# EAGLE design SaLAltimeter (EAGLE 7.5.0)
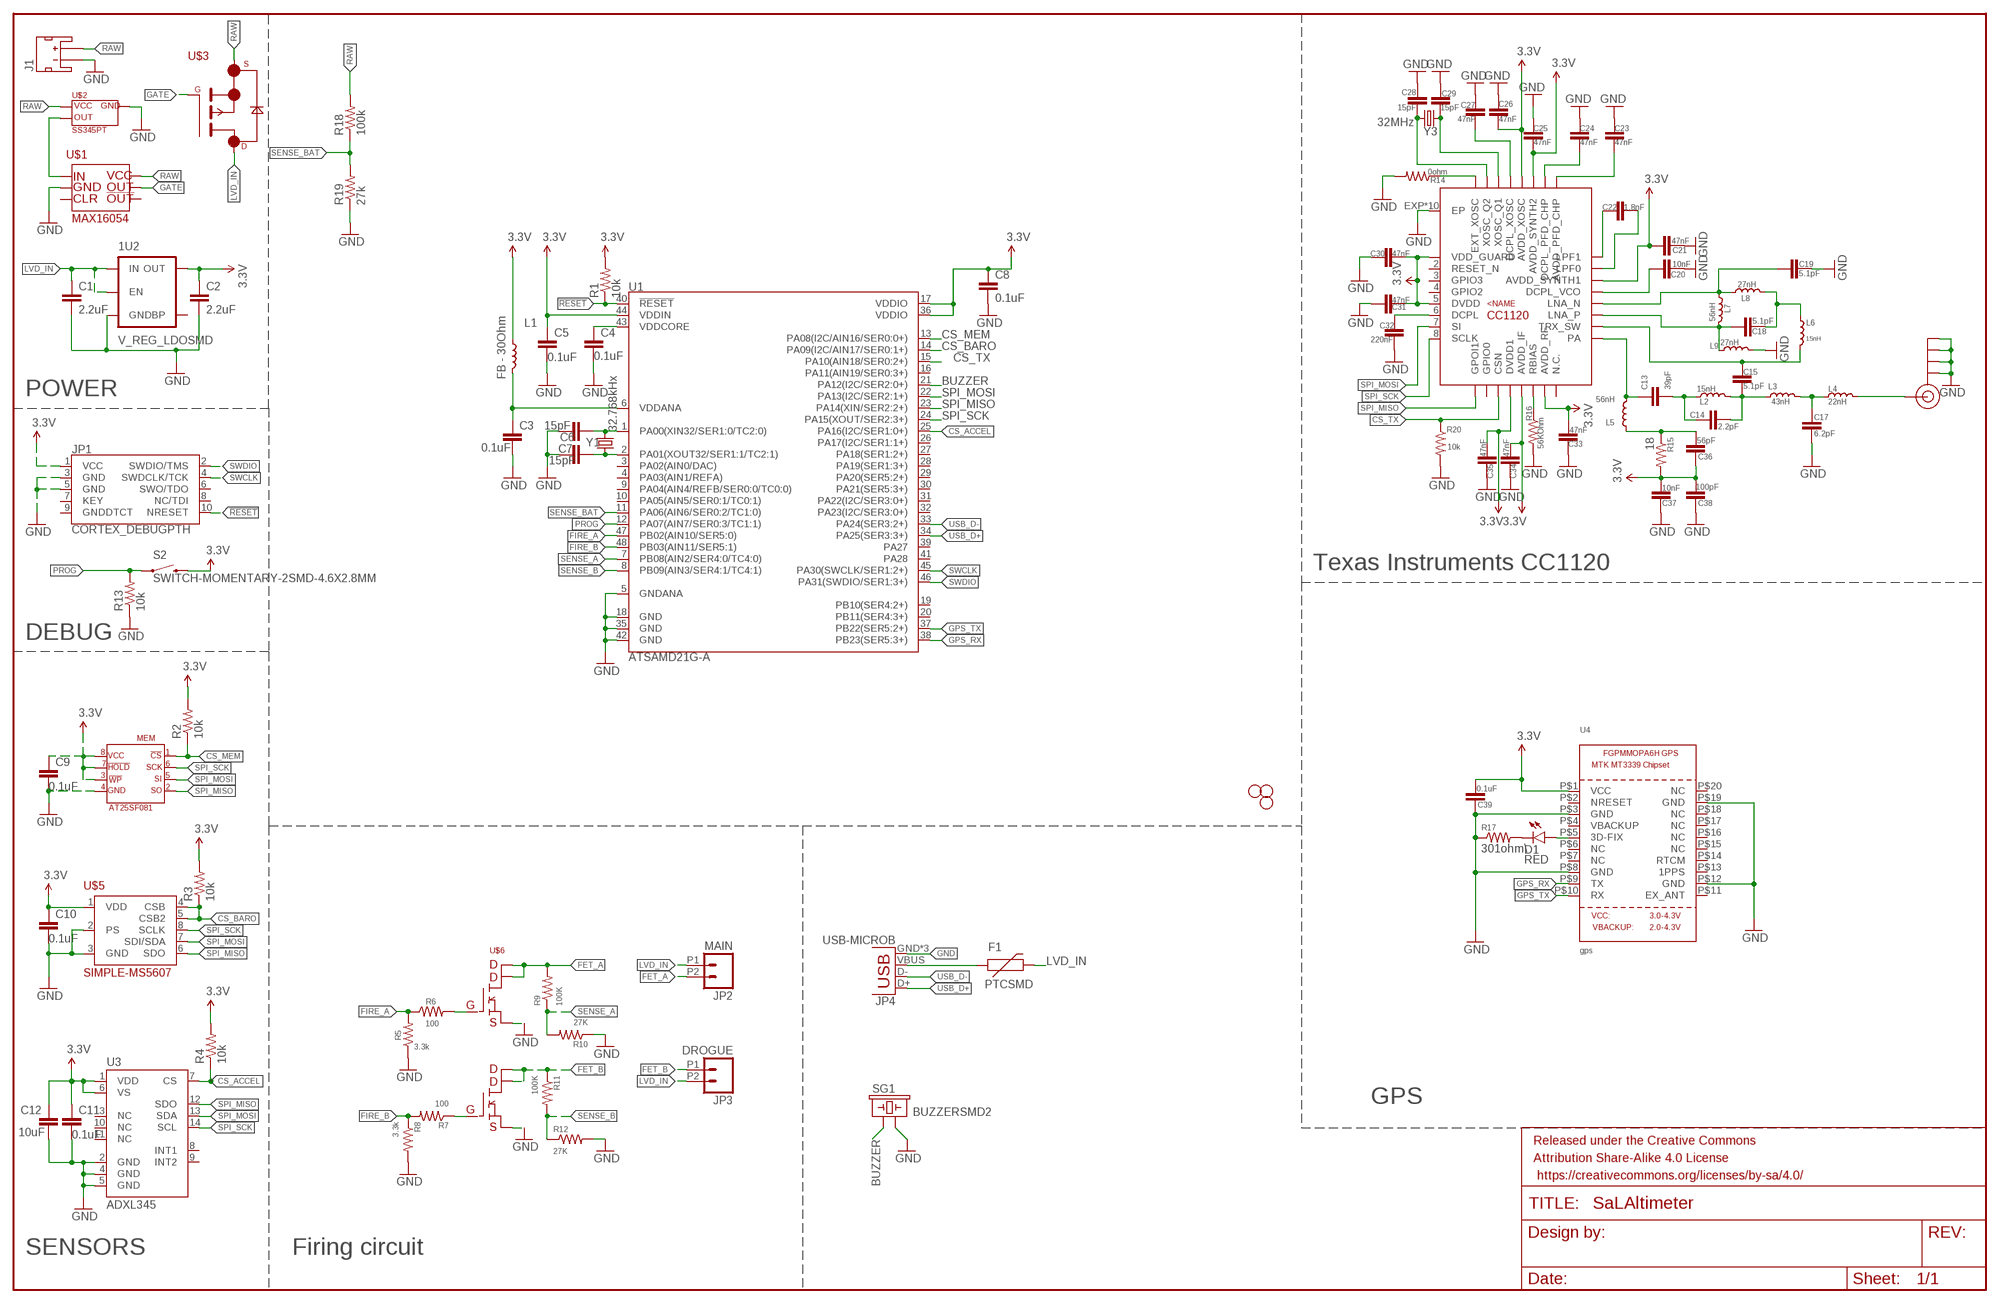
[diagram p0: schematic, sheet 1]

## Parts
1U2  V_REG_LDOSMD  [SOT23-5]
C1  2.2uF  CAP0603-CAP  [0603-CAP]
C2  2.2uF  CAP0603-CAP  [0603-CAP]
C3  0.1uF  CAP0402-CAP  [0402-CAP]
C4  0.1uF  CAP0402-CAP  [0402-CAP]
C5  0.1uF  CAP0402-CAP  [0402-CAP]
C6  15pF  CAP0402-CAP  [0402-CAP]
C7  15pF  CAP0402-CAP  [0402-CAP]
C8  0.1uF  CAP0402-CAP  [0402-CAP]
C9  0.1uF  CAP0402-CAP  [0402-CAP]
C10  0.1uF  CAP0402-CAP  [0402-CAP]
C11  0.1uF  CAP0402-CAP  [0402-CAP]
C12  10uF  CAP0402-CAP  [0402-CAP]
C13  39pF  CAP0402-CAP  [0402-CAP]
C14  2.2pF  CAP0402-CAP  [0402-CAP]
C15  5.1pF  CAP0402-CAP  [0402-CAP]
C17  6.2pF  CAP0402-CAP  [0402-CAP]
C18  5.1pF  CAP0402-CAP  [0402-CAP]
C19  5.1pF  CAP0402-CAP  [0402-CAP]
C20  10nF  CAP0402-CAP  [0402-CAP]
C21  47nF  CAP0402-CAP  [0402-CAP]
C22  1.8nF  CAP0402-CAP  [0402-CAP]
C23  47nF  CAP0402-CAP  [0402-CAP]
C24  47nF  CAP0402-CAP  [0402-CAP]
C25  47nF  CAP0402-CAP  [0402-CAP]
C26  47nF  CAP0402-CAP  [0402-CAP]
C27  47nF  CAP0402-CAP  [0402-CAP]
C28  15pF  CAP0402-CAP  [0402-CAP]
C29  15pF  CAP0402-CAP  [0402-CAP]
C30  47nF  CAP0402-CAP  [0402-CAP]
C31  47nF  CAP0402-CAP  [0402-CAP]
C32  220nF  CAP0402-CAP  [0402-CAP]
C33  47nF  CAP0402-CAP  [0402-CAP]
C34  47nF  CAP0402-CAP  [0402-CAP]
C35  47nF  CAP0402-CAP  [0402-CAP]
C36  56pF  CAP0402-CAP  [0402-CAP]
C37  10nF  CAP0402-CAP  [0402-CAP]
C38  100pF  CAP0402-CAP  [0402-CAP]
C39  0.1uF  CAP0402-CAP  [0402-CAP]
D1  RED  LED-RED0603  [LED-0603]
F1  PTCSMD  [PTC-1206]
FRAME1  FRAME-LEDGER  [CREATIVE_COMMONS]
J1  BAT  JST_2MM_MALE  [JST-2-SMD]
J$1  SMA_EDGE  [SMA-EDGE]
JP1  CORTEX_DEBUGPTH  [2X5-PTH-1.27MM]
JP2  MAIN  M022.54MM_SCREWTERM  [1X02_2.54_SCREWTERM]
JP3  DROGUE  M022.54MM_SCREWTERM  [1X02_2.54_SCREWTERM]
JP4  USB-MICROB  [USB-MICROB]
L1  FB - 30Ohm  INDUCTOR0603  [0603]
L2  15nH  INDUCTOR0402  [C0402]
L3  43nH  INDUCTOR0402  [C0402]
L4  22nH  INDUCTOR0402  [C0402]
L5  56nH  INDUCTOR0402  [C0402]
L6  15nH  INDUCTOR0402  [C0402]
L7  56nH  INDUCTOR0402  [C0402]
L8  27nH  INDUCTOR0402  [C0402]
L9  27nH  INDUCTOR0402  [C0402]
MEM  AT25SF081  [AT25SF081]
R1  10k  RESISTOR0402-RES  [0402-RES]
R2  10k  RESISTOR0402-RES  [0402-RES]
R3  10k  RESISTOR0402-RES  [0402-RES]
R4  10k  RESISTOR0402-RES  [0402-RES]
R5  3.3k  RESISTOR0402  [0402-RES]
R6  100  RESISTOR0402  [0402-RES]
R7  100  RESISTOR0402  [0402-RES]
R8  3.3k  RESISTOR0402  [0402-RES]
R9  100K  RESISTOR0402  [0402-RES]
R10  27K  RESISTOR0402  [0402-RES]
R11  100K  RESISTOR0402  [0402-RES]
R12  27K  RESISTOR0402  [0402-RES]
R13  10k  RESISTOR0402-RES  [0402-RES]
R14  0ohm  RESISTOR0402-RES  [0402-RES]
R15  18  RESISTOR0402-RES  [0402-RES]
R16  56KOhm  RESISTOR0402-RES  [0402-RES]
R17  301ohm\  RESISTOR0402-RES  [0402-RES]
R18  100k  RESISTOR0402-RES  [0402-RES]
R19  27k  RESISTOR0402-RES  [0402-RES]
R20  10k  RESISTOR0402-RES  [0402-RES]
S2  SWITCH-MOMENTARY-2SMD-4.6X2.8MM  [TACTILE_SWITCH_SMD_4.6X2.8MM]
SG1  BUZZERSMD2  [BUZZER-CCV]
STANDOFF1  STAND-OFF  [STAND-OFF]
STANDOFF2  STAND-OFF  [STAND-OFF]
STANDOFF3  STAND-OFF  [STAND-OFF]
U1  ATSAMD21G-A  [TQFP-48]
U2  CC1120  [CC1120]
U3  ADXL345  [LGA14]
U4  gps  GPS_FGPMMOPA6H  [FGPMMOPA6H]
U$1  MAX16054  [MAX16054]
U$2  SS345PT  [SS345PT]
U$3  SI7615ADN  [SI7615ADN]
U$5  SIMPLE-MS5607  [MS5607]
U$6  SI7232DN  [SI7232DN]
Y1  32.768kHx  CRYSTAL3.2X1.5MM  [CRYSTAL-SMD-3.2X1.5MM]
Y3  32MHz  CRYSTAL5X3  [CRYSTAL-SMD-5X3]

## Nets
3.3V: 1U2.5(OUT) C2.1 C5.1 C8.1 C9.1 C10.1 C11.1 C12.1 C21.1 C25.2 C26.2 C30.2 C31.2 C33.2 C34.2 C35.2 C36.1 C37.2 C38.2 C39.2 JP1.1(VCC) L1.1 MEM.!HOLD MEM.!WP MEM.VCC R1.2 R2.2 R3.2 R4.2 R15.2 S2.3 S2.4 U1.17(VDDIO) U1.36(VDDIO) U1.44(VDDIN) U2.1(VDD_GUARD) U2.5(DVDD) U2.12(DVDD1) U2.13(AVDD_IF) U2.15(AVDD_RF) U2.22(AVDD_SYNTH1) U2.27(AVDD_SYNTH2) U2.28(AVDD_XOSC) U3.1(VDD) U3.6(VS) U4.P$1(VCC) U$5.1(VDD)
!RESET: JP1.10(NRESET) R1.1 U1.40(!RESET!)
BUZZER: SG1.+ U1.21(PA12(I2C/SER2:0+))
CS_ACCEL: R4.1 U1.25(PA16(I2C/SER1:0+)) U3.7(CS)
CS_BARO: R3.1 U1.14(PA09(I2C/AIN17/SER0:1+)) U$5.4(CSB) U$5.5(CSB2)
CS_MEM: MEM.!CS R2.1 U1.13(PA08(I2C/AIN16/SER0:0+))
CS_TX: R20.1 U1.15(PA10(AIN18/SER0:2+)) U2.11(CSN)
FET_A: JP2.P2 R9.2 U$6.7(PIN7) U$6.8(PIN8)
FET_B: JP3.P1 R11.1 U$6.5(PIN5) U$6.6(PIN6)
FIRE_A: R5.2 R6.1 U1.47(PB02(AIN10/SER5:0))
FIRE_B: R7.2 R8.1 U1.48(PB03(AIN11/SER5:1))
GATE: U$1.OUT U$3.G
GND: 1U2.2(GND) C1.2 C2.2 C3.2 C4.2 C5.2 C6.2 C7.2 C8.2 C9.2 C10.2 C11.2 C12.2 C17.2 C19.2 C20.2 C21.2 C23.1 C24.1 C25.1 C26.1 C27.1 C28.1 C29.1 C30.1 C31.1 C32.1 C33.1 C34.1 C35.1 C37.1 C38.1 C39.1 J1.1(-) J$1.GND@0(GND) J$1.GND@1(GND) J$1.GND@2(GND) J$1.GND@3(GND) JP1.3(GND) JP1.5(GND) JP4.GND JP4.MT1(GND) JP4.MT2(GND) L9.2 MEM.GND R5.1 R8.2 R10.1 R12.2 R13.1 R14.2 R16.2 R17.1 R19.1 R20.2 SG1.- U1.5(GNDANA) U1.18(GND) U1.35(GND) U1.42(GND) U2.EXP(EP) U2.EXP@1(EP) U2.EXP@2(EP) U2.EXP@3(EP) U2.EXP@4(EP) U2.EXP@5(EP) U2.EXP@6(EP) U2.EXP@7(EP) U2.EXP@8(EP) U2.EXP@9(EP) U3.2(GND) U3.4(GND) U3.5(GND) U4.P$3(GND) U4.P$8(GND) U4.P$12(GND) U4.P$19(GND) U$1.GND U$2.GND U$5.2(PS) U$5.3(GND) U$6.1(PIN1) U$6.3(PIN3)
GPS_RX: U1.38(PB23(SER5:3+)) U4.P$9(TX)
GPS_TX: U1.37(PB22(SER5:2+)) U4.P$10(RX)
LVD_IN: 1U2.1(IN) 1U2.3(EN) C1.1 F1.2 JP2.P1 JP3.P2 U$3.D1(D) U$3.D2(D) U$3.D3(D) U$3.D4(D)
N$1: R6.2 U$6.2(PIN2)
N$2: U$1.IN U$2.OUT
N$3: C6.1 U1.1(PA00(XIN32/SER1:0/TC2:0)) Y1.P$2
N$4: C7.1 U1.2(PA01(XOUT32/SER1:1/TC2:1)) Y1.P$1
N$5: C3.1 L1.2 U1.6(VDDANA)
N$6: C4.1 U1.43(VDDCORE)
N$8: R7.1 U$6.4(PIN4)
N$9: C13.1 L5.2 U2.17(PA)
N$10: C13.2 C14.1 L2.1
N$11: C14.2 C15.1 L2.2 L3.1
N$12: C17.1 L3.2 L4.1
N$13: J$1.SIG(SIGNAL) L4.2
N$14: F1.1 JP4.VBUS
N$15: C23.2 U2.25(AVDD_PFD_CHP)
N$16: C15.2 L6.2 U2.18(TRX_SW)
N$17: C18.1 L7.2 L9.1 U2.19(LNA_P)
N$18: C18.2 L6.1 L8.2
N$19: C19.1 L7.1 L8.1 U2.20(LNA_N)
N$20: C22.1 U2.24(LPF1)
N$21: C22.2 U2.23(LPF0)
N$22: C20.1 U2.21(DCPL_VCO)
N$23: C24.2 U2.26(DCPL_PFD_CHP)
N$24: R16.1 U2.14(RBIAS)
N$25: R14.1 U2.32(EXT_XOSC)
N$26: C27.2 U2.29(DCPL_XOSC)
N$27: C29.2 U2.30(XOSC_Q1) Y3.3
N$28: C28.2 U2.31(XOSC_Q2) Y3.1
N$30: D1.C R17.2
N$31: D1.A U4.P$5(3D-FIX)
N$34: C32.2 U2.6(DCPL)
N$38: C36.2 L5.1 R15.1
PROG: R13.2 S2.1 S2.2 U1.12(PA07(AIN7/SER0:3/TC1:1))
RAW: J1.2(+) R18.2 U$1.VCC U$2.VCC U$3.S1(S) U$3.S2(S) U$3.S3(S)
SENSE_A: R9.1 R10.2 U1.7(PB08(AIN2/SER4:0/TC4:0))
SENSE_B: R11.2 R12.1 U1.8(PB09(AIN3/SER4:1/TC4:1))
SENSE_BAT: R18.1 R19.2 U1.11(PA06(AIN6/SER0:2/TC1:0))
SPI_MISO: MEM.SO U1.23(PA14(XIN/SER2:2+)) U2.9(GPOI1) U3.12(SDO) U$5.6(SDO)
SPI_MOSI: MEM.SI U1.22(PA13(I2C/SER2:1+)) U2.7(SI) U3.13(SDA) U$5.7(SDI/SDA)
SPI_SCK: MEM.SCK U1.24(PA15(XOUT/SER2:3+)) U2.8(SCLK) U3.14(SCL) U$5.8(SCLK)
SWCLK: JP1.4(SWDCLK/TCK) U1.45(PA30(SWCLK/SER1:2+))
SWDIO: JP1.2(SWDIO/TMS) U1.46(PA31(SWDIO/SER1:3+))
USB_D+: JP4.D+ U1.34(PA25(SER3:3+))
USB_D-: JP4.D- U1.33(PA24(SER3:2+))
Unconnected: 1U2.4(BP) J1.NC1(PAD1) J1.NC2(PAD2) JP1.6(SWO/TDO) JP1.7(KEY) JP1.8(NC/TDI) JP1.9(GNDDTCT) U1.3(PA02(AIN0/DAC)) U1.4(PA03(AIN1/REFA)) U1.9(PA04(AIN4/REFB/SER0:0/TC0:0)) U1.10(PA05(AIN5/SER0:1/TC0:1)) U1.16(PA11(AIN19/SER0:3+)) U1.19(PB10(SER4:2+)) U1.20(PB11(SER4:3+)) U1.26(PA17(I2C/SER1:1+)) U1.27(PA18(SER1:2+)) U1.28(PA19(SER1:3+)) U1.29(PA20(SER5:2+)) U1.30(PA21(SER5:3+)) U1.31(PA22(I2C/SER3:0+)) U1.32(PA23(I2C/SER3:0+)) U1.39(PA27) U1.41(PA28) U2.2(RESET_N) U2.3(GPIO3) U2.4(GPIO2) U2.10(GPIO0) U2.16(N.C.) U3.3(NC) U3.8(INT1) U3.9(INT2) U3.10(NC) U3.11(NC) U4.P$2(NRESET) U4.P$4(VBACKUP) U4.P$6(NC) U4.P$7(NC) U4.P$11(EX_ANT) U4.P$13(1PPS) U4.P$14(RTCM) U4.P$15(NC) U4.P$16(NC) U4.P$17(NC) U4.P$18(NC) U4.P$20(NC) U$1.!OUT U$1.CLR

## Notes on the sheet
- POWER
- Texas Instruments CC1120
- DEBUG
- GPS
- SENSORS | Firing circuit

## Library data of the parts
1U2 = SparkFun-PowerIC:V_REG_LDO: Voltage Regulator LDO Standard 150mA LDO voltage regulator in SOT-23 layout. Micrel part MIC5205. BP (by-pass) pin is used to lower output noise with 470pF cap.
C1 C2 C13-C15 C17-C39 = SparkFun-Capacitors:CAP: Capacitor Standard 0603 ceramic capacitor, and 0.1" leaded capacitor.
C3-C12 = SparkFun-Passives:CAP: Capacitor Standard 0603 ceramic capacitor, and 0.1" leaded capacitor.
D1 = SparkFun-LED:LED-RED: Assorted Red LEDs LilyPad 1206- DIO-09912 1206- DIO-00809 0603- DIO-00819 "SMART" means more efficient and expensive; PROD_ID: DIO-00819
F1 = SparkFun-PowerIC:PTC: Resettable Fuse PTC Resettable Fuse. Spark Fun Electronics SKU : COM-08357; PROD_ID: RES-11150
FRAME1 = SparkFun-Aesthetics:FRAME-LEDGER: Schematic Frame Standard 11x14 US Ledger frame
J1 = SparkFun-Connectors:JST_2MM_MALE: Mates to single-cell LiPo batteries. CONN-11443 Now with smashable polarity marks!; BTM_NEG: -; BTM_POS: +; PROD_ID: CONN-11443; TOP_NEG: -; TOP_POS: +
J$1 = SparkFun-Connectors:SMA_EDGE: SMA Antenna Connector End launch SMA connector. The paste layer has been removed so that the connector can be hand soldered onto the board after reflow.
JP1 = SparkFun-Connectors:CORTEX_DEBUG: Cortex Debug Connector Datasheet <http://infocenter.arm.com/help/topic/com.arm.doc.faqs/attached/13634/cortex_debug_connectors.pdf>
JP2 JP3 = SparkFun-Connectors:M02: Standard 2-pin 0.1" header. Use with - straight break away headers ( PRT-00116) - right angle break away headers (PRT-00553) - swiss pins (PRT-00743) - machine pins (PRT-00117) - female headers (PRT-00115) Molex polarized connector foot print use with: PRT-08233 with associated crimp pins and housings. 2.54_SCREWTERM for use with PRT-10571. 3.5mm Screw Terminal footprints for PRT-08084 5mm Screw Terminal footprints for use with PRT-08432
JP4 = SparkFun-Connectors:USB: USB Connectors USB-B-PTH is fully proven SKU : PRT-00139/CONN-08278 USB-miniB is fully proven SKU : PRT-00587 USB-A-PCB is untested. USB-A-H is throughly reviewed, but untested. Spark Fun Electronics SKU : PRT-00437 USB-B-SMT is throughly reviewed, but untested. Needs silkscreen touching up. USB-A-S has not been used/tested USB-MB-H has not been used/tested USB-MICROB has been used. CONN-09505; PROD_ID: CONN-09505
L1-L9 = SparkFun-Passives:INDUCTOR: Inductors Basic Inductor/Choke - 0603 and 1206. Footprints are not proven and vary greatly between part numbers. INDUCTOR POWER 3.3UH 4.0A SMD 0.197" L x 0.197" W x 0.177" H (5.00mm x 5.00mm x 4.50mm)
MEM = SaL-lib:AT25SF081: AT25SF081 - 8M memory smd
R1-R4 R13-R20 = SparkFun-Passives:RESISTOR: Resistor Basic schematic elements and footprints for 0603, 1206, and PTH resistors.
R5-R12 = SparkFun-Resistors:RESISTOR: Resistor Basic schematic elements and footprints for 0603, 1206, and PTH resistors.
S2 = SparkFun-Electromechanical:SWITCH-MOMENTARY-2: Various NO switches- pushbuttons, reed, etc; PROD_ID: SWCH-13065
SG1 = SparkFun-Electromechanical:BUZZER: Buzzer 12mm Spark Fun Electronics SKU : Comp-Buzzer
STANDOFF1-STANDOFF3 = SparkFun-Electromechanical:STAND-OFF: #4 Stand Off This is the mechanical footprint for a #4 phillips button head screw. Use the keepout ring to avoid running the screw head into surrounding components. SKU : PRT-00447
U1 = SparkFun-DigitalIC:ATSAMD21G: Atmel SAMD21G SMART ARM-Based Microcontroller The Atmel ® | SMART ™ SAM D21 is a series of low-power microcontrollers using the 32-bit ARM ® Cortex ® -M0+ processor, and ranging from 32- to 64-pins with up to 256KB Flash and 32KB of SRAM. The SAM D21 devices operate at a maximum frequency of 48MHz and reach 2.46 CoreMark/MHz. They are designed for simple and intuitive migration with identical peripheral modules, hex compatible code, identical linear address map and pin compatible migration paths between all devices in the product series. All devices include intelligent and flexible peripherals, Atmel Event System for inter-peripheral signaling, and support for capacitive touch button, slider and wheel user interfaces.; PROD_ID: IC-13064
U2 = SaL-lib:CC1120
U3 = SparkFun-Sensors:ADXL345: 3-axis SPI/I2C 2/4/8/16g accelerometer
U4 = adafruit:GPS_FGPMMOPA6H: GPS Module - MTK MT3339 Chipset, -165dBm sensitivity, 22 channels, 10Hz, auto-select external antenna options
U$1 = SaL-lib:MAX16054
U$2 = SaL-lib:SS345PT
U$3 = SaL-lib:SI7615ADN
U$5 = MS5607:SIMPLE
U$6 = SaL-lib:SI7232DN: SI7232DN dual
Y1 = SparkFun-FreqCtrl:CRYSTAL: Various standard crystals. Proven footprints.
Y3 = SparkFun-FreqCtrl:CRYSTAL: Various standard crystals. Proven footprints.; PROD_ID: XTAL-08218

## Board
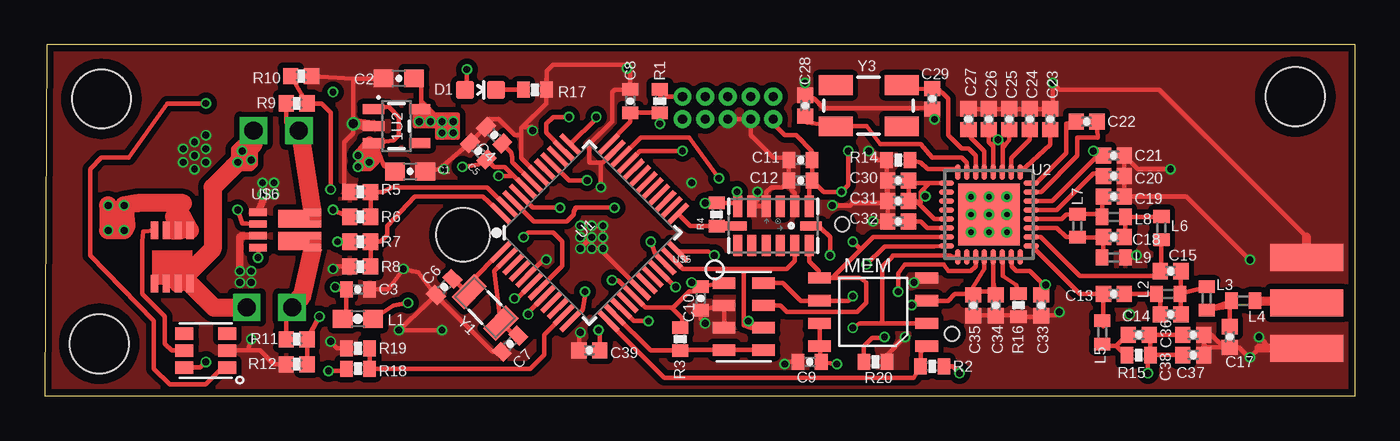
[diagram p1: board, top side]
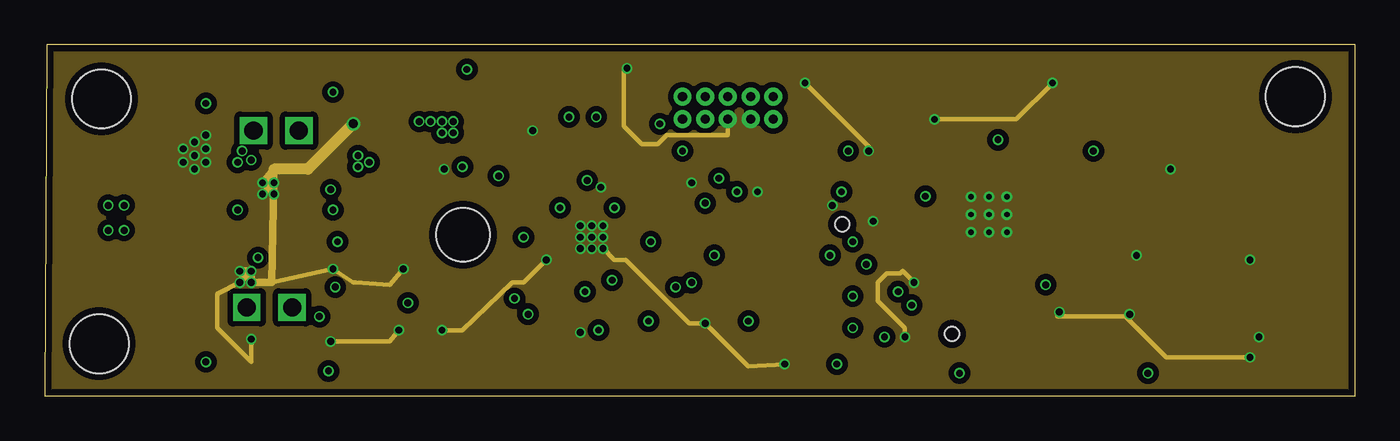
[diagram p2: board, inner layer Route2]
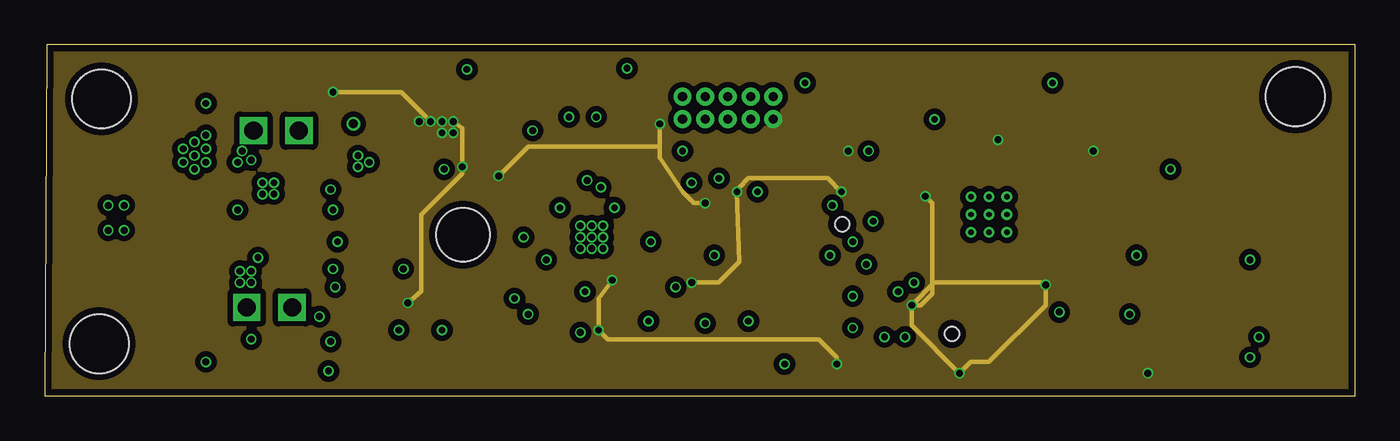
[diagram p3: board, inner layer Route15]
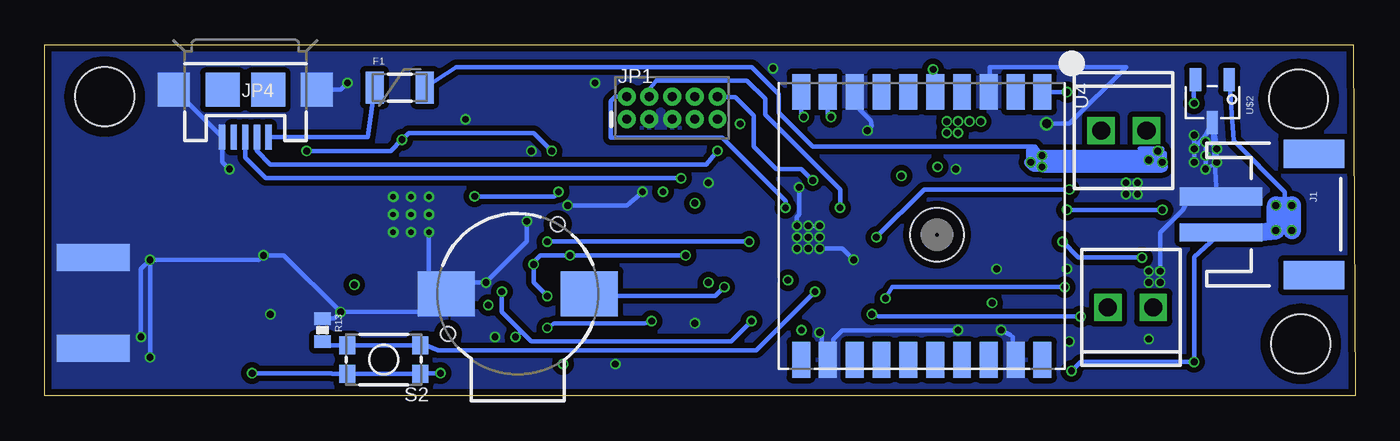
[diagram p4: board, bottom side, seen from below]

Size 73.33 x 19.68 mm. Coordinates in mm from the lower left corner, seen from the top.
Outline: 0,0 73.33,0 73.33,19.68 0.13,19.68 0,0
Copper layers (1*2*15*16): Top 0.035559375mm / dielectric 0.17018125mm / Route2 0.01778125mm / dielectric 47mil / Route15 0.01778125mm / dielectric 0.17018125mm / Bottom 0.035559375mm
Design rules "OSHPark-4layer-SaL *": minimum track width 5mil, minimum drill 10mil, track to track 8mil, track to pad 8mil, pad to pad 8mil, via to via 10mil, smd to smd 0mil, copper to edge 15mil, drill to drill 6mil, minimum pad ring 4mil, minimum via ring 4mil, stop-mask expansion 0mil, vias tented up to drill 20mil, thermal gap 0mil

### Footprints (pad centres in the part's own frame; a part is rotated, then mirrored left to right if it is on the bottom)
SOT23-5 = smd 0.55 x 1.2: 1 -0.95,-1.3; 2 0,-1.3; 3 0.95,-1.3; 4 0.95,1.3; 5 -0.95,1.3
0603-CAP = smd 1.1 x 1: 1 -0.85,0; 2 0.85,0
0402-CAP = smd 0.7 x 0.9: 1 -0.65,0; 2 0.65,0
0402-CAP' = smd 0.85 x 0.9: 1 -0.58,0; 2 0.58,0
LED-0603 = smd 1 x 1: A 0,-0.877; C 0,0.877
PTC-1206 = smd 1 x 1.8: 1 -1.4,0; 2 1.4,0
JST-2-SMD = smd 1 x 4.6: 1 -1,-3.7; 2 1,-3.7 | smd 1.6 x 3.4: NC1 -3.4,1.5; NC2 3.4,1.5
SMA-EDGE = smd 1.524 x 4.064: GND@0 0,0; GND@1 5.08,0; SIG 2.54,0 | smd 1.524 x 4.064 bottom: GND@2 0,0; GND@3 5.08,0
2X5-PTH-1.27MM = drill 0.508 pad 1: 1 -2.54,-0.635; 2 -2.54,0.635; 3 -1.27,-0.635; 4 -1.27,0.635; 5 0,-0.635; 6 0,0.635; 7 1.27,-0.635; 8 1.27,0.635; 9 2.54,-0.635; 10 2.54,0.635
1X02_2.54_SCREWTERM = drill 1.016 square: P1 2.54,0; P2 0,0
USB-MICROB = smd 0.35 x 1.4: D+ 0,2.65; D- -0.65,2.65; GND 1.3,2.65; ID 0.65,2.65; VBUS -1.3,2.65 | smd 1.8 x 1.9: MT1 -4,0; MT2 4,0 | smd 1.9 x 1.9: P$1 -1.27,0; P$2 1.27,0
0603 = smd 1.1 x 1: 1 -0.85,0; 2 0.85,0
C0402 = smd 0.7 x 0.9: 1 -0.65,0; 2 0.65,0
AT25SF081 = smd 1.27 x 0.635: !CS -3,2.54; !HOLD 3,1.27; !WP -3,0; GND -3,-1.27; SCK 3,0; SI 3,-1.27; SO -3,1.27; VCC 3,2.54
0402-RES = smd 0.7 x 0.9: 1 -0.65,0; 2 0.65,0
0402-RES' = smd 0.85 x 0.9: 1 -0.58,0; 2 0.58,0
TACTILE_SWITCH_SMD_4.6X2.8MM = smd 0.9 x 1: 1 -2.05,-0.8; 2 2.05,-0.8; 3 2.05,0.8; 4 -2.05,0.8
BUZZER-CCV = smd 3.2 x 2.5: + 4,0; - -4,0 | hole 0.8: -3.9,-2.25; 2.25,3.9
STAND-OFF = hole 3.302: 0,0
TQFP-48 = smd 1.5 x 0.28: 1 -4.25,2.75; 2 -4.25,2.25; 3 -4.25,1.75; 4 -4.25,1.25; 5 -4.25,0.75; 6 -4.25,0.25; 7 -4.25,-0.25; 8 -4.25,-0.75; 9 -4.25,-1.25; 10 -4.25,-1.75; 11 -4.25,-2.25; 12 -4.25,-2.75; 25 4.25,-2.75; 26 4.25,-2.25; 27 4.25,-1.75; 28 4.25,-1.25; 29 4.25,-0.75; 30 4.25,-0.25; 31 4.25,0.25; 32 4.25,0.75; 33 4.25,1.25; 34 4.25,1.75; 35 4.25,2.25; 36 4.25,2.75 | smd 0.28 x 1.5: 13 -2.75,-4.25; 14 -2.25,-4.25; 15 -1.75,-4.25; 16 -1.25,-4.25; 17 -0.75,-4.25; 18 -0.25,-4.25; 19 0.25,-4.25; 20 0.75,-4.25; 21 1.25,-4.25; 22 1.75,-4.25; 23 2.25,-4.25; 24 2.75,-4.25; 37 2.75,4.25; 38 2.25,4.25; 39 1.75,4.25; 40 1.25,4.25; 41 0.75,4.25; 42 0.25,4.25; 43 -0.25,4.25; 44 -0.75,4.25; 45 -1.25,4.25; 46 -1.75,4.25; 47 -2.25,4.25; 48 -2.75,4.25
CC1120 = smd 0.85 x 0.3: 1 -2.375,1.75; 2 -2.375,1.25; 3 -2.375,0.75; 4 -2.375,0.25; 5 -2.375,-0.25; 6 -2.375,-0.75; 7 -2.375,-1.25; 8 -2.375,-1.75; 17 2.375,-1.75; 18 2.375,-1.25; 19 2.375,-0.75; 20 2.375,-0.25; 21 2.375,0.25; 22 2.375,0.75; 23 2.375,1.25; 24 2.375,1.75 | smd 0.3 x 0.85: 9 -1.75,-2.375; 10 -1.25,-2.375; 11 -0.75,-2.375; 12 -0.25,-2.375; 13 0.25,-2.375; 14 0.75,-2.375; 15 1.25,-2.375; 16 1.75,-2.375; 25 1.75,2.375; 26 1.25,2.375; 27 0.75,2.375; 28 0.25,2.375; 29 -0.25,2.375; 30 -0.75,2.375; 31 -1.25,2.375; 32 -1.75,2.375 | smd 3.45 x 3.45: EXP 0,0 | drill 0.3 pad 0.6: EXP@1 -1,1; EXP@2 0,1; EXP@3 1,1; EXP@4 -1,0; EXP@5 0,0; EXP@6 1,0; EXP@7 -1,-1; EXP@8 0,-1; EXP@9 1,-1
LGA14 = smd 0.5 x 1.2: 1 2,1.1; 2 1.2,1.1; 3 0.4,1.1; 4 -0.4,1.1; 5 -1.2,1.1; 6 -2,1.1; 8 -2,-1.1; 9 -1.2,-1.1; 10 -0.4,-1.1; 11 0.4,-1.1; 12 1.2,-1.1; 13 2,-1.1 | smd 1.2 x 0.5: 7 -2.1,0; 14 2.1,0
FGPMMOPA6H = smd 2 x 1: P$1 -7.5,6.75; P$2 -7.5,5.25; P$3 -7.5,3.75; P$4 -7.5,2.25; P$5 -7.5,0.75; P$6 -7.5,-0.75; P$7 -7.5,-2.25; P$8 -7.5,-3.75; P$9 -7.5,-5.25; P$10 -7.5,-6.75; P$11 7.5,-6.75; P$12 7.5,-5.25; P$13 7.5,-3.75; P$14 7.5,-2.25; P$15 7.5,-0.75; P$16 7.5,0.75; P$17 7.5,2.25; P$18 7.5,3.75; P$19 7.5,5.25; P$20 7.5,6.75 | hole 3: 0.5,0.85
MAX16054 = smd 1 x 0.7: !OUT 1.2,-0.95; CLR -1.2,-0.95; GND -1.2,0; IN -1.2,0.95; OUT 1.2,0; VCC 1.2,0.95
SS345PT = smd 1.27 x 0.635: GND 1.2,0; OUT -1.2,-0.95; VCC -1.2,0.95
SI7615ADN = smd 0.99 x 0.405: D1 2.985,0; D2 2.985,-0.66; D3 2.985,-1.32; D4 2.985,-1.98; G 0,-1.98; S1 0,0; S2 0,-0.66; S3 0,-1.32
MS5607 = smd 1.27 x 0.635: 1 -1.1,1.875; 2 -1.1,0.625; 3 -1.1,-0.625; 4 -1.1,-1.875; 5 1.1,-1.875; 6 1.1,-0.625; 7 1.1,0.625; 8 1.1,1.875
SI7232DN = smd 0.991 x 0.406: 1 0,0; 2 0,-0.66; 3 0,-1.321; 4 0,-1.981; 5 3.048,-1.981; 6 3.048,-1.321; 7 3.048,-0.66; 8 3.048,0 | smd 1.727 x 0.991: P$9 1.994,-0.368; P$10 1.994,-1.615
CRYSTAL-SMD-3.2X1.5MM = smd 1 x 1.8: P$1 -1.25,0; P$2 1.25,0
CRYSTAL-SMD-5X3 = smd 1.9 x 1.1: 1 -1.85,-1.15; 2 1.85,-1.15; 3 1.85,1.15; 4 -1.85,1.15

### Placement (x,y rotation side)
1U2  19.68,15.11 270 top
C1  20.45,12.57 0 top
C2  19.81,17.78 180 top
C3  17.53,5.97 0 top
C4  25.15,14.61 135 top
C5  24.26,13.72 135 top
C6  22.35,6.1 225 top
C7  26.04,2.92 225 top
C8  32.77,16.51 90 top
C9  42.8,1.91 180 top
C10  36.7,5.46 270 top
C11  42.29,13.21 180 top
C12  42.29,12.06 180 top
C13  39pF  [0402-CAP']  59.82,5.71 0 top
C14  2.2pF  [0402-CAP']  62.99,4.57 0 top
C15  5.1pF  [0402-CAP']  62.99,6.99 180 top
C17  6.2pF  [0402-CAP']  66.29,3.3 270 top
C18  5.1pF  [0402-CAP']  59.82,8.89 0 top
C19  5.1pF  [0402-CAP']  59.82,11.18 0 top
C20  10nF  [0402-CAP']  59.82,12.32 0 top
C21  47nF  [0402-CAP']  59.82,13.46 0 top
C22  1.8nF  [0402-CAP']  58.29,15.37 0 top
C23  47nF  [0402-CAP']  56.26,15.49 270 top
C24  47nF  [0402-CAP']  55.12,15.49 270 top
C25  47nF  [0402-CAP']  53.98,15.49 270 top
C26  47nF  [0402-CAP']  52.83,15.49 270 top
C27  47nF  [0402-CAP']  51.69,15.49 270 top
C28  15pF  [0402-CAP']  42.55,16.26 270 top
C29  15pF  [0402-CAP']  49.66,16.64 90 top
C30  47nF  [0402-CAP']  47.75,12.06 0 top
C31  47nF  [0402-CAP']  47.75,10.92 0 top
C32  220nF  [0402-CAP']  47.75,9.78 0 top
C33  47nF  [0402-CAP']  55.75,5.08 90 top
C34  47nF  [0402-CAP']  53.21,5.08 90 top
C35  47nF  [0402-CAP']  51.94,5.08 90 top
C36  56pF  [0402-CAP']  61.21,3.43 180 top
C37  10nF  [0402-CAP']  64.26,2.29 180 top
C38  100pF  [0402-CAP']  64.26,3.43 180 top
C39  0.1uF  [0402-CAP']  30.48,2.54 0 top
D1  24.38,17.14 270 top
F1  53.47,17.27 0 bottom
FRAME1  -0.51,23.5 0 top  (outside the outline)
J1  3.81,10.16 270 bottom
J$1  70.61,2.67 90 top
JP1  38.23,16.13 0 bottom
JP2  14.22,14.86 0 bottom
JP3  11.3,4.95 180 bottom
JP4  62.1,17.14 180 bottom
L1  17.53,4.32 180 top
L2  62.87,5.71 0 top
L3  65.02,5.46 270 top
L4  67.06,5.33 0 top
L5  59.18,3.56 90 top
L6  62.48,9.4 270 top
L7  57.79,9.53 270 top
L8  59.82,10.03 0 top
L9  59.82,7.75 0 top
MEM  46.36,5.33 180 top
R1  34.42,16.51 270 top
R2  49.66,1.65 0 top
R3  35.56,3.17 90 top
R4  37.59,10.16 90 top
R5  3.3k  [0402-RES']  17.65,11.43 0 top
R6  100  [0402-RES']  17.65,10.03 180 top
R7  100  [0402-RES']  17.65,8.64 0 top
R8  3.3k  [0402-RES']  17.65,7.24 180 top
R9  100K  [0402-RES']  14.1,16.38 180 top
R10  27K  [0402-RES']  14.35,17.91 180 top
R11  100K  [0402-RES']  14.1,3.17 0 top
R12  27K  [0402-RES']  14.1,1.78 180 top
R13  57.79,3.68 270 bottom
R14  47.75,13.21 180 top
R15  61.21,2.29 0 top
R16  54.48,5.08 270 top
R17  27.43,17.14 180 top
R18  17.53,1.52 180 top
R19  17.53,2.67 0 top
R20  46.48,1.91 0 top
S2  54.36,2.03 180 bottom
SG1  46.86,5.71 0 bottom
STANDOFF1  69.98,16.76 0 top
STANDOFF2  3.17,16.64 0 top
STANDOFF3  3.05,2.92 0 top
U1  30.48,9.14 45 top
U2  52.83,10.16 0 top
U3  40.77,9.53 0 top
U4  24.26,9.53 270 bottom
U$1  9.02,2.54 180 top
U$2  8,16.51 270 bottom
U$3  8.13,9.27 270 top
U$5  39.12,4.45 0 top
U$6  11.94,10.29 0 top
Y1  24.64,4.95 135 top
Y3  46.1,16.26 0 top

### Tracks (layer width: path | path; a pad name or v marks a point on that pad's centre or on a via)
3.3V  (via drill 0.38)
  Top 0.254: U2.22 56.38,10.91 58.93,13.46 59.05,13.46 | 59.05,13.46 C21.1 | C25.2 53.98,14.35 53.59,13.84 | 53.59,13.84 53.59,12.55 U2.27 | C26.2 52.83,14.22 53.09,13.97 | U2.28 53.09,13.97 | U2.5 49.78,9.91 48.77,10.93 48.46,10.93 C31.2 C30.2 48.81,11.91 U2.1 49.5,11.91 49.02,11.43 | U2.15 54.1,7.76 54.1,7.24 54.36,6.99 55.12,6.99 55.75,6.35 C33.2 56.01,5.91 v56.01,6.22 | C34.2 53.09,6.35 U2.13 53.08,5.97 53.21,5.84 52.12,5.84 C35.2 | U2.12 52.58,7.11 51.94,6.1 C35.2 | R15.2 61.86,3.36 C36.1 C38.2 | R15.2 C37.2 | U1.36 32.13,14.68 32.13,14.73 32.77,15.37 C8.1 R1.2 v34.42,15.24 | L1.1 19.52,5.08 v20.32,5.21 | v23.37,12.83 24.26,12.95 24.59,13.29 C5.1 25.1,12.88 25.15,12.83 25.74,12.83 U1.44 26.24,12.32 v25.4,12.32 | 22.1,15.37 v21.59,15.37 v20.95,15.37 20.95,16.03 1U2.5 21.08,16.06 21.08,16.51 | 22.1,15.37 v22.22,15.37 v22.86,15.37 | 22.1,15.37 22.1,14.48 | 22.1,14.48 23.11,14.48 23.11,15.11 | 23.11,15.49 22.86,15.49 | 22.86,15.49 21.21,15.49 21.21,16 20.83,16 20.83,15.24 22.86,15.24 22.99,15.37 22.99,15.75 | 22.99,15.75 21.46,15.75 21.34,15.62 21.34,15.88 21.46,16 20.7,16 20.7,15.24 | 20.7,15.24 20.83,15.11 | 20.83,15.11 23.11,15.11 | 23.11,15.11 23.11,15.49 | 23.11,15.49 23.11,15.75 22.99,15.75 | 22.86,15.49 22.86,14.86 22.99,14.73 v22.86,14.73 | v22.86,14.73 22.48,14.73 22.35,14.61 | 22.35,14.61 22.35,14.99 22.61,14.99 22.73,14.86 22.1,14.86 21.97,14.99 21.97,14.48 22.1,14.48 | 20.7,15.24 20.7,15.11 20.83,15.11 | 21.08,16.51 21.08,17.78 C2.1 | C10.1 37.97,6.37 U$5.1 | MEM.!HOLD MEM.VCC C9.1 v44.32,1.78 | U3.1 42.77,11.98 C12.1 | C12.1 C11.1 42.93,13.22 42.93,13.72 42.04,14.61 41.4,14.61 40.77,15.24 JP1.1
  Top 0.254: C10.1 36.43,5.84 36.07,5.84 35.18,4.95 35.05,4.95 | 35.05,4.95 33.61,4.95 U1.17 32.09,6.48 v31.75,6.48 | R3.2 35.69,4.32 35.05,4.95 | v36.96,10.79 36.97,10.81 R4.2 38.58,10.81 U3.6 38.77,11.46 v38.73,11.43 | C39.2 31.06,3.61 v30.99,3.68 | R2.2 50.8,1.65 v51.18,1.27 | C35.2 51.89,5.71 50.93,5.71 50.55,5.33 MEM.!WP 48.77,5.33 v48.51,5.08 | v61.72,1.27 61.72,2.14 R15.2 | 49.02,11.43 v49.28,11.18 | C12.1 43.58,11.43 v44.58,11.43 44.96,11.81 v44.96,13.72 | 49.02,11.43 49.02,10.79 | 53.09,13.97 53.09,14.1 v53.34,14.35 53.59,14.1 53.59,13.84 | v58.67,13.72 58.8,13.72 59.05,13.46 | v36.2,6.35 36.46,6.35 C10.1 | v22.86,14.73 21.08,16.51 | v22.22,14.73 22.35,14.61
  Route15 0.254: v20.32,5.21 21.08,5.84 21.08,10.16 23.37,12.45 v23.37,12.83 23.37,14.99 v22.86,15.37 | v16.13,17.02 19.94,17.02 v21.59,15.37 | v34.42,15.24 34.42,13.97 | 34.42,13.97 34.42,13.34 35.69,11.43 36.32,10.79 v36.96,10.79 | v25.4,12.32 27.05,13.97 34.42,13.97 | v31.75,6.48 30.99,5.46 v30.99,3.68 31.5,3.17 43.31,3.17 44.32,2.16 v44.32,1.78 | v48.51,5.08 48.51,3.94 v51.18,1.27 51.82,1.91 52.83,1.91 56.01,5.08 v56.01,6.22 | 48.39,5.08 v48.51,5.08 | v48.51,5.08 49.02,5.08 49.66,5.71 49.66,10.79 v49.28,11.18 | v44.58,11.43 43.82,12.19 39.37,12.19 38.86,11.68 v38.73,11.43 38.86,7.49 37.72,6.35 v36.2,6.35 | 56.01,6.35 49.78,6.35 v48.51,5.08
  Bottom 0.254: U4.P$1 v16.14,17.02 v16.13,17.02 | v51.18,1.27 52.27,1.27 S2.4 S2.3 57.24,1.23 57.28,1.27 v61.72,1.27 | v49.28,11.18 44.83,11.18 v44.58,11.43 | v44.96,13.72 45.97,14.73 52.96,14.73 v53.34,14.35 53.98,13.72 v58.67,13.72
  pour Route15 (isolate 0.305): -1.14,20.95 74.42,20.95 74.42,-3.17 -1.14,-3.17
!RESET  (via drill 0.38)
  Top 0.254: R1.1 34.43,16.76 JP1.10 | U1.40 29.34,12.06 v30.35,12.06
  Bottom 0.254: v30.35,12.06 30.99,12.7 32.38,12.7 33.66,13.97 33.66,15.7 34.68,16.73 35.73,16.73 JP1.10
BUZZER  (via drill 0.38)
  Top 0.254: U1.21 35.17,6.22 v35.31,6.1
  Bottom 0.254: v35.31,6.1 35.81,5.59 41.53,5.59 41.66,5.71 SG1.+
CS_ACCEL
  Top 0.254: U3.7 38.65,9.51 R4.1 36.12,9.51 U1.25
CS_BARO
  Top 0.254: U1.14 33.91,2.54 34.42,2.54 35.56,2.56 R3.1 35.61,2.57 U$5.4 U$5.5
CS_MEM
  Top 0.254: U1.13 31.54,4.15 34.67,1.02 48.63,1.02 R2.1 49.01,2.45 MEM.!CS
CS_TX  (via drill 0.38)
  Top 0.254: U2.11 52.08,7.25 51.82,6.99 50.55,6.99 50.29,7.37 48.13,7.37 47.75,6.86 v47.75,5.84 | v33.78,4.19 32.96,4.19 U1.15 | R20.1 45.83,2.78 46.29,3.24 46.93,3.24 v46.99,3.3
  Bottom 0.254: v47.75,5.84 47.75,4.7 46.67,3.62 | 46.67,3.62 46.1,3.05 34.93,3.05 v33.78,4.19 | v46.99,3.3 46.67,3.62
FET_A
  Top 0.254: R9.2 13.52,15.31 13.97,14.86 JP2.P2 | U$6.8 U$6.7 14.99,9.65 15.24,9.91 15.37,9.78 15.37,10.16
  Top 1.016: U$6.8 14.35,14.48 14.22,14.61 JP2.P2
FET_B
  Top 0.254: R11.1 13.52,4.63 JP3.P1 13.84,5.08 | U$6.5 U$6.6 15.19,8.76 15.24,8.76 15.37,8.64 | 15.37,8.89 15.37,8.64 | 15.37,8.51 15.37,8.64
  Top 1.016: U$6.5 14.35,5.46 14.22,5.46 13.84,5.08
FIRE_A
  Top 0.254: R6.1 R5.2 18.92,11.43 19.43,11.68 24.77,11.68 25.92,10.54 25.91,10.54 25.27,11.18 25.27,11.17 U1.47
FIRE_B
  Top 0.254: R8.1 R7.2 18.8,8.64 19.18,9.02 19.18,9.53 20.7,11.18 24.51,11.18 25.46,10.29 25.53,10.22 U1.48
GATE
  Top 0.254: U$1.OUT 7.11,2.54 6.73,2.92 6.73,4.45 5.46,5.71 5.46,8.64 5.51,9.2 U$3.G
GND  (via drill 0.38, 0.51)
  Top 0.254: C27.1 C26.1 C25.1 C24.1 C23.1 56.39,16.2 v56.39,17.53 56.77,17.14 62.36,17.14 70.61,8.89 | C38.1 C37.1 | C38.1 64.91,2.72 C17.2 66.8,2.72 66.89,2.63 | v11.56,3.17 11.36,2.54 | U$1.GND 11.36,2.54 | 11.36,2.54 12.07,2.54 12.83,1.78 R12.2 | v16.13,7.11 16.13,7.24 R8.2 | C3.2 19.19,5.97 19.43,6.22 v20.07,7.11 20.91,6.91 C6.2 | C6.2 25.07,2.46 C7.2 | C1.2 22.07,12.7 C5.2 C4.2 24.86,15.49 25.4,15.49 26.29,14.61 26.67,14.61 | U1.42 26.67,13.31 26.67,14.61 | C2.2 17.27,17.78 | 17.27,17.78 v17.27,15.24 17.27,14.73 16.76,14.22 16.76,11.74 R5.1 | 26.73,15.05 28.07,16.38 28.07,17.77 R17.1 28.08,18.18 28.45,18.54 32.38,18.54 v32.58,18.35 32.77,18.16 C8.2 31.89,17.16 31.75,17.02 31.75,15.37 30.48,14.1 30.48,13.08 31.11,13.08 | 26.73,15.05 26.67,14.99 26.67,14.61 | v27.3,14.86 27.24,15.05 26.73,15.05 | U1.35 31.23,13.08 31.11,13.08 | 31.11,13.08 v31.11,11.68 | C6.2 v19.81,3.68 v22.22,3.68 | R10.1 17.27,17.78 | U$5.3 U$5.2 C10.2 36.7,4.32 v36.96,4.06 | U3.2 41.97,11.37 41.78,11.56 41.78,11.92 C12.2 | C12.2 C11.2 41.51,13.34 40.77,13.34 39.5,14.61 JP1.3 JP1.5 | C12.2 41.26,11.68 40.64,11.68 40.37,11.41 U3.4 U3.5 39.88,10.94 v39.88,11.43 | C35.1 C34.1 54.41,4.5 R16.2 55.68,4.43 C33.1 56.57,4.5 v56.77,4.7 | 47.1,12.13 R14.2 46.61,13.21 v46.1,13.72 | 47.1,12.13 C30.1 C31.1 C32.1 v46.36,9.78 | R19.1 16.38,2.67 v16,3.05 | U1.5 27.89,7.62 v28.07,7.62 | v29.97,9.53 v31.24,9.53 v31.24,8.89 v31.24,8.26 | v31.24,8.26 v30.61,8.26 v30.61,8.89 | v30.61,8.89 v29.97,8.89 | v30.61,8.89 v29.97,8.26 | U1.18 31.24,8.03 v31.24,8.26 | v29.97,3.56 29.9,3.36 C39.1 | C9.2 41.66,1.91 v41.4,1.78 | MEM.GND 48.9,6.6 v48.64,6.35
  Top 0.254: L9.2 60.96,7.75 v61.09,7.87 | C38.1 65.28,3.43 66.17,2.54 | 66.89,2.63 67.36,2.16 v67.44,2.16 67.94,2.67 | v62.99,12.7 61.16,12.7 C21.2 C20.2 C19.2 63.88,11.18 v67.44,7.62 67.56,7.75 | 47.1,12.13 47.1,10.81 47.12,10.79 45.21,10.79 45.09,10.67 v44.07,10.67 | v42.55,17.53 C28.1 42.74,16.64 43.05,16.64 43.56,16.13 48.9,16.13 49.6,16.18 C29.1 49.66,15.62 v49.78,15.49 | 66.93,2.67 66.89,2.63 | 68.58,2.67 v67.94,3.3 | R20.2 47.13,2.3 v48.13,3.3 | U2.EXP@1 U2.EXP@2 | U2.EXP@1 U2.EXP@3 U2.EXP@6 54.1,10.16 | U2.EXP@5 U2.EXP@4 | U2.EXP@4 U2.EXP@1 | U2.EXP@4 U2.EXP@7 | U2.EXP@7 U2.EXP@8 | U2.EXP@7 U2.EXP@9
  Top 0.406: U$6.1 12.19,10.92 v12.19,11.3 | U$6.3 11,8.97 10.92,8.89 v10.92,6.99
  Top 0.508: J$1.GND@0 67.94,2.67 | J$1.GND@1 70.61,8.89
  Top 0.61: 1U2.2 v17.27,15.24
  Route2 0.254: v10.92,6.35 9.65,5.71 9.65,3.81 11.56,1.91 v11.56,3.17 | 12.7,6.35 v16.13,7.11 17.27,6.35 17.4,6.35 19.3,6.22 v20.07,7.11 | v16,3.05 19.3,3.05 v19.81,3.68 | v28.07,7.62 26.8,6.35 26.16,6.35 23.37,3.68 v22.22,3.68 | v31.24,8.26 31.88,7.62 32.51,7.62 36.07,4.06 v36.96,4.06 39.37,1.65 v41.4,1.78 | v46.1,13.72 46.1,13.97 v42.55,17.53 | v49.78,15.49 54.36,15.49 v56.39,17.53 | JP1.5 38.23,14.61 34.8,14.61 34.29,14.1 33.4,14.1 32.38,15.11 32.38,18.16 v32.58,18.35 | v67.44,2.16 62.74,2.16 60.45,4.45 56.64,4.45 | v10.92,6.99 v11.56,6.99 | v48.13,3.3 48.13,3.81 46.61,5.33 46.61,6.35 47.12,6.86 47.88,6.86 48.01,6.99 v48.64,6.35
  Route2 0.406: v12.19,11.3 v12.83,11.94 | v12.83,11.94 12.83,12.7 v12.19,11.94 v12.83,11.94 | v10.92,6.99 11.43,6.99 v10.92,6.35 | v11.56,6.99 v11.56,6.35 12.7,6.35 v12.83,11.94 | v12.83,11.94 v12.83,11.3
  Route2 0.61: v17.27,15.24 14.73,12.7 12.83,12.7
  Bottom 0.254: U$2.GND 7.75,11.27 | 7.75,11.27 J1.1 | 7.75,11.27 9.18,11.27 9.65,10.41 10.92,9.14 v10.92,6.99 | v7.75,13.84 v7.75,13.08 v8.38,12.7 v8.38,14.22 | v8.38,14.22 v8.38,13.46 | v8.38,14.22 7.75,14.04 U$2.GND | U$2.GND 8.38,14.61 v9.02,13.84 | v9.02,13.84 v9.02,14.61 | v9.02,13.84 v9.02,13.08 | U4.P$8 27.75,16.77 27.75,16.07 27.11,15.43 27.05,15.11 v27.3,14.86 | U4.P$19 19.18,2.19 19.18,3.3 19.3,3.43 v19.81,3.68 | v31.11,11.68 31.11,10.16 31.24,10.03 v31.24,9.53 | U4.P$3 20.45,17.09 20.45,18.41 12.83,18.41 16,15.24 v17.27,15.24 | v29.97,3.56 29.84,3.3 29.84,2.36 U4.P$12 29.21,2.32 29.21,3.17 28.7,3.68 v22.22,3.68 | v28.07,7.62 28.7,8.26 v29.97,8.26 | v56.77,4.7 51.88,4.7 SG1.- | SG1.- 50.23,6.35 v48.64,6.35 46.36,8.64 v46.36,9.78 | R13.1 57.14,4.33 v56.77,4.7 | v56.77,4.7 59.94,7.87 v61.09,7.87 61.34,7.62 v67.44,7.62 | v67.44,7.62 v67.44,2.16 | JP4.MT2 66.05,17.14 JP4.GND 63.4,13.11 v62.99,12.7 | JP4.MT1 56.77,17.14 v56.39,17.53 | v44.07,10.67 40.77,10.67 v39.88,11.43 | v29.97,9.53 v30.61,9.53 | v67.94,3.3 67.94,7.11 v67.44,7.62 | U2.EXP@7 51.83,6.68 SG1.-
  other vias: 36.2,11.94 60.71,4.57 22.35,12.7
  pour Bottom (isolate 0.305): -1.14,20.95 74.42,20.95 74.42,-1.27 -1.14,-1.27
  pour Top (isolate 0.305): -1.14,20.95 74.42,20.95 74.42,-1.91 -1.14,-1.91
  pour Route2 (isolate 0.305): -1.14,20.95 74.42,20.95 74.42,-2.54 -1.14,-2.54
GPS_RX  (via drill 0.38)
  Top 0.254: U1.38 28.07,14.74 28.07,15.24 28.45,15.62 v29.34,15.62
  Bottom 0.254: v29.34,15.62 29.51,15.79 U4.P$9
GPS_TX  (via drill 0.38)
  Top 0.254: U1.37 30.86,15.54 v30.86,15.62
  Bottom 0.254: v30.86,15.62 31.01,15.77 U4.P$10
LVD_IN  (via drill 0.38)
  Top 0.254: C1.1 18.96,12.91 18.54,13.97 18.54,14.26 1U2.3 19.5,14.29 19.81,14.61 19.81,15.62 19.24,16.19 1U2.1 | 11.56,14.61 11.56,14.22 | 11.56,14.22 11.56,13.97 11.56,13.08 11.18,12.7 11.43,12.7 11.68,12.95 11.68,14.1 11.56,14.22 | 11.56,14.22 11.81,14.22 11.81,12.95 11.56,12.7 10.67,12.7 10.54,12.83 10.54,13.84 10.92,14.22 | U$3.D3 U$3.D2 | U$3.D1 U$3.D2 | U$3.D2 7.68,6.29 7.75,6.35 6.21,6.35 U$3.D4
  Top 0.508: v18.16,13.08 18.41,13.08 | 18.41,13.08 18.67,13.34 | 18.41,13.08 18.16,12.83 v17.53,12.83
  Top 0.61: v17.53,12.83 18.54,13.97 | v17.53,13.46 18.16,14.22
  Top 1.016: U$3.D1 9.46,4.95 JP3.P2 | v11.05,13.72 11.05,13.34 v10.79,13.08 10.54,12.83 9.4,11.68 9.4,8.22 U$3.D2 | JP2.P1 11.68,14.1 11.56,13.97
  Bottom 0.254: F1.2 50.29,18.41 33.78,18.41 32.26,16.89 32.26,15.88 30.35,13.97 17.91,13.97 v17.53,13.46 | 17.4,13.21 v11.56,13.21 11.18,13.21 10.92,13.46 10.79,13.34 v10.79,13.08 | 10.92,13.34 10.92,13.21 10.67,12.95 10.67,13.59 10.79,13.72 10.79,13.84 | 10.79,13.84 12.07,13.84 | 10.79,13.84 10.92,13.72 v11.05,13.72
  Bottom 0.508: 17.53,13.08 v18.16,13.08 | v18.16,13.08 18.29,13.08 18.03,12.83 17.4,12.83 17.4,13.34 v17.53,13.46 17.78,13.46 v18.16,13.08 | v18.16,13.08 18.16,13.72 18.03,13.72 17.91,13.59
  Bottom 0.61: 10.92,13.46 v17.53,13.46 17.53,13.08 v17.53,12.83 17.4,12.83 10.79,12.83
N$1  (via drill 0.38)
  Top 0.254: U$6.2 11.3,9.65 11.05,9.65 v10.79,10.41 | v16.13,10.41 R6.2
  Bottom 0.254: v10.79,10.41 v16.13,10.41
N$2  (via drill 0.38)
  Top 0.254: v9.02,16.38 6.86,16.38 4.7,13.34 3.17,13.34 2.54,12.7 2.54,7.87 6.1,4.19 6.1,1.52 6.98,0.64 9.02,0.64 9.97,1.59 U$1.IN
  Bottom 0.254: U$2.OUT 9.08,17.71 v9.02,16.38
N$3
  Top 0.254: U1.1 23.77,6.32 Y1.P$2 23.76,5.71 C6.1
N$4
  Top 0.254: U1.2 25.15,6.99 Y1.P$1 | 24.89,3.81 Y1.P$1 | Y1.P$1 26.28,3.44 C7.1
N$5  (via drill 0.38)
  Top 0.254: U1.6 26.44,5.46 v26.29,5.46 | v16.26,6.1 16.26,5.97 C3.1 16.88,4.52 L1.2
  Bottom 0.254: v26.29,5.46 25.91,6.1 v16.26,6.1
N$6
  Top 0.254: U1.43 26.16,13.11 26.16,13.34 26.11,13.64 C4.1
N$8  (via drill 0.38)
  Top 0.254: U$6.4 v11.94,7.75 | v16.38,8.64 R7.1
  Bottom 0.254: v11.94,7.75 15.49,7.75 v16.38,8.64
N$9
  Top 0.254: U2.17 55.22,8.41 57.91,5.71 C13.1 59.24,3.88 L5.2
N$10
  Top 0.254: C14.1 62.41,5.64 L2.1 C13.2
N$11
  Top 0.254: C15.1 63.57,5.79 L2.2 | L2.2 L3.1 | C14.2 63.57,5.64 L2.2
N$12
  Top 0.254: C17.1 66.31,5.01 L3.2 L4.1
N$13
  Top 0.508: L4.2 70.48,5.33 J$1.SIG
N$14
  Bottom 0.254: F1.1 55.27,14.49 JP4.VBUS
N$15
  Top 0.254: U2.25 56.26,14.09 C23.2
N$16
  Top 0.254: L6.2 62.48,7.04 62.36,7.04 C15.2 62.16,6.73 57.91,6.73 55.73,8.91 U2.18
N$17
  Top 0.254: U2.19 56.63,9.41 57.15,8.89 57.26,8.89 L7.2 59.22,8.88 C18.1 59.24,7.69 L9.1
N$18
  Top 0.254: C18.2 60.47,8.96 L8.2 62.22,10.03 L6.1
N$19
  Top 0.254: U2.20 56.9,9.91 57.15,10.16 57.26,10.16 L7.1 59.15,10.18 L8.1 59.17,11.36 C19.1
N$20
  Top 0.254: U2.24 55.46,11.9 57.15,13.59 57.15,15.24 C22.1
N$21
  Top 0.254: U2.23 55.23,11.43 55.75,11.43 57.79,13.46 57.79,14.48 58.93,14.48 C22.2
N$22
  Top 0.254: U2.21 56.64,10.41 58.67,12.45 58.98,12.45 C20.1
N$23
  Top 0.254: U2.26 54.08,13.31 55.12,14.35 C24.2
N$24
  Top 0.254: U2.14 53.59,7.77 53.59,6.73 54.36,6.22 R16.1
N$25
  Top 0.254: U2.32 50.92,12.7 49.4,12.7 49.02,13.08 R14.1
N$26
  Top 0.254: C27.2 51.82,14.48 52.58,13.72 U2.29
N$27
  Top 0.254: U2.30 52.08,13.45 51.69,13.84 51.31,13.84 50.55,14.61 50.55,16.64 49.84,17.34 C29.2 47.82,17.15 Y3.3
N$28
  Top 0.254: C28.2 42.67,15.29 Y3.1 45.98,15.11 46.74,14.1 49.02,14.1 49.66,13.34 51.31,13.34 51.58,13.06 U2.31
N$30
  Top 0.254: D1.C R17.2
N$31  (via drill 0.38)
  Top 0.254: D1.A 23.62,17.26 v23.62,18.29
  Bottom 0.254: v23.62,18.29 23.51,18.3 U4.P$5
N$34
  Top 0.254: U2.6 49.39,9.41 49.02,9.78 C32.2
N$38
  Top 0.254: L5.1 59.29,2.79 59.94,2.79 | 59.94,2.79 60.58,3.43 C36.2 | 59.94,2.79 60.45,2.29 R15.1
PROG  (via drill 0.38)
  Top 0.254: v30.23,5.84 30.23,5.76 30.27,5.89 30.1,4.83 U1.12
  Bottom 0.254: R13.2 57.38,2.83 S2.2 S2.1 51.98,2.83 51.31,2.54 33.53,2.54 v30.23,5.84
RAW  (via drill 0.38)
  Top 0.254: U$3.S3 7.11,9.27 U$3.S2 7.62,9.27 U$3.S1 | U$1.VCC 8.7,1.59 v9.02,1.91 | R18.2 16.75,1.4 v15.88,1.4
  Top 1.016: U$3.S1 7.49,10.41 7.75,10.79 5.21,10.79 v4.45,10.67 4.57,9.53 v4.45,9.27 v3.56,9.27 | v3.56,9.27 4.06,9.4 v3.56,10.67 v3.56,9.27 | 7.11,9.27 7.62,9.27 7.62,9.65 7.24,10.03
  Bottom 0.254: J1.2 9.02,7.78 v9.02,1.91 15.37,1.91 v15.88,1.4 | U$2.VCC 6.8,14.29 3.94,11.43 3.94,10.67
  Bottom 1.016: J1.2 5.57,9.16 v4.45,9.27 v4.45,10.67 3.94,10.67 v3.56,10.67 v3.56,9.27
SENSE_A  (via drill 0.38)
  Top 0.254: R10.2 R9.1 15.49,16.38 16,15.88 v16,11.56 | U1.7 28.96,7.27 28.96,8.64 28.45,9.14 27.05,9.14 v26.8,8.89
  Bottom 0.254: v26.8,8.89 24.13,11.56 v16,11.56
SENSE_B  (via drill 0.38)
  Top 0.254: R12.1 R11.2 v15.37,4.45 | v27.05,4.57 27.1,4.7 U1.8
  Bottom 0.254: v15.37,4.45 26.67,4.45 v27.05,4.57
SENSE_BAT
  Top 0.254: U1.11 27.94,3.42 27.94,2.29 27.18,1.52 R18.1 R19.2
SPI_MISO  (via drill 0.38)
  Top 0.254: U3.12 41.97,7.55 41.53,7.11 39.12,7.11 | 39.12,7.11 39.12,3.94 39.5,3.81 | 39.5,3.81 U$5.6 | MEM.SO 46.74,4.06 | 46.74,4.06 45.59,4.06 v45.21,3.81 | v39.37,4.19 39.5,3.94 39.5,3.81 | 46.74,4.06 46.86,4.19 46.86,7.24 47.41,7.79 47.45,7.87 50.67,7.87 50.76,7.79 U2.9 | U1.23 35.69,7.11 39.12,7.11
  Bottom 0.254: v45.21,3.81 44.83,4.06 39.75,4.06 v39.37,4.19
SPI_MOSI  (via drill 0.38)
  Top 0.254: 44.07,6.6 MEM.SI 43.31,6.65 43.31,6.99 42.77,7.53 U3.13 | 44.07,6.6 45.59,6.6 45.97,6.35 45.97,5.21 45.47,4.7 41.53,4.7 41.15,5.08 40.23,5.08 U$5.7 | U2.7 49.68,8.91 49.53,8.89 46.36,8.89 45.66,8.19 | 45.66,8.19 44.07,6.6 | U1.22 34.16,7.94 v33.91,8.64 | v45.21,8.64 45.66,8.19
  Bottom 0.254: v33.91,8.64 v45.21,8.64
SPI_SCK  (via drill 0.38)
  Top 0.254: U$5.8 41.3,6.32 42.29,5.33 MEM.SCK 44.96,5.33 v45.21,5.59 | U2.8 49.78,8.38 46.99,8.38 v45.97,7.37 | v43.94,7.87 43.94,8.89 43.43,9.4 42.99,9.4 U3.14 | U1.24 37.13,8.08 v37.47,7.87
  Bottom 0.254: v45.21,5.59 45.97,6.35 v45.97,7.37 45.97,7.49 45.59,7.87 v43.94,7.87 v37.47,7.87
SWCLK  (via drill 0.38)
  Top 0.254: v28.83,10.54 27.3,10.54 26.59,11.26 U1.45
  Bottom 0.254: JP1.4 39.5,17.14 39.12,17.65 34.04,17.65 33.02,16.64 33.02,15.75 28.83,11.56 v28.83,10.54
SWDIO  (via drill 0.38)
  Top 0.254: U1.46 27.37,9.78 29.21,9.78 29.59,10.16 29.59,10.29 29.72,10.54 v31.88,10.54
  Bottom 0.254: JP1.2 41.4,16.76 41.66,16.51 41.66,14.48 35.43,14.48 31.88,10.92 v31.88,10.54
USB_D+  (via drill 0.38)
  Top 0.254: U1.34 33.34,14.48 36.07,14.48 v37.72,12.19
  Bottom 0.254: v37.72,12.19 60.96,12.19 62.1,13.34 JP4.D+
USB_D-  (via drill 0.38)
  Top 0.254: U1.33 33.28,13.72 v35.69,13.72
  Bottom 0.254: v35.69,13.72 36.32,12.95 60.71,12.95 61.45,13.73 JP4.D-